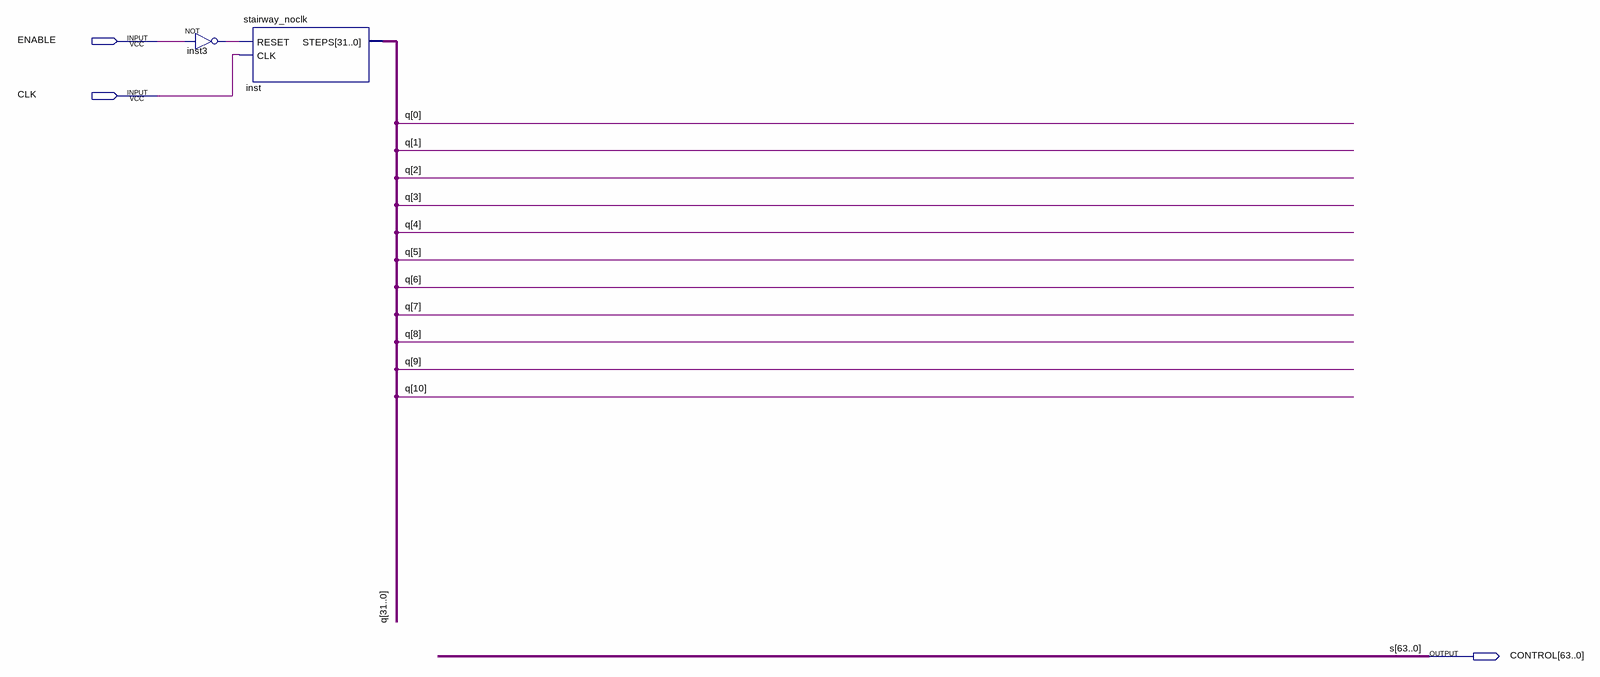
[diagram p0: schematic sheet]
// Quartus schematic macro_template.bdf as structural Verilog: 2 symbols, 3 pins
module macro_template (
  input  ENABLE,
  input  CLK,
  output [63:0] CONTROL
);

  wire inst3_out;
  wire [31:0] q;

  not inst3 (inst3_out, ENABLE);
  stairway_noclk inst (.RESET(inst3_out), .CLK(CLK), .STEPS(q));

  // Other names for the same wires on the sheet: s[63:0] = CONTROL
endmodule
